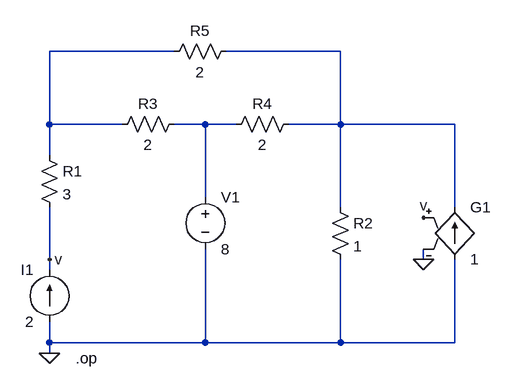
[diagram p0: schematic CH03-KP2-10.asc]
CH03-KP2-10.asc, the LTspice schematic file:
Version 4
SHEET 1 880 680
WIRE 160 96 -32 96
WIRE 416 96 240 96
WIRE -32 208 -32 96
WIRE 80 208 -32 208
WIRE 208 208 160 208
WIRE 256 208 208 208
WIRE 416 208 416 96
WIRE 416 208 336 208
WIRE 592 208 416 208
WIRE -32 256 -32 208
WIRE 208 320 208 208
WIRE 416 336 416 208
WIRE 592 336 592 208
WIRE -32 416 -32 336
WIRE 544 416 544 400
WIRE -32 432 -32 416
WIRE -32 544 -32 512
WIRE 208 544 208 400
WIRE 208 544 -32 544
WIRE 416 544 416 416
WIRE 416 544 208 544
WIRE 592 544 592 416
WIRE 592 544 416 544
WIRE -32 560 -32 544
FLAG -32 560 0
FLAG -32 416 v
FLAG 544 352 v
FLAG 544 416 0
DATAFLAG -32 368 "$"
SYMBOL res -48 240 R0
SYMATTR InstName R1
SYMATTR Value 3
SYMBOL res 400 320 R0
SYMATTR InstName R2
SYMATTR Value 1
SYMBOL res 176 192 R90
WINDOW 0 0 56 VBottom 2
WINDOW 3 32 56 VTop 2
SYMATTR InstName R3
SYMATTR Value 2
SYMBOL res 352 192 R90
WINDOW 0 0 56 VBottom 2
WINDOW 3 32 56 VTop 2
SYMATTR InstName R4
SYMATTR Value 2
SYMBOL res 256 80 R90
WINDOW 0 0 56 VBottom 2
WINDOW 3 32 56 VTop 2
SYMATTR InstName R5
SYMATTR Value 2
SYMBOL current -32 512 R180
WINDOW 0 24 80 Left 2
WINDOW 3 24 0 Left 2
SYMATTR InstName I1
SYMATTR Value 2
SYMBOL voltage 208 304 R0
SYMATTR InstName V1
SYMATTR Value 8
SYMBOL g 592 320 R0
SYMATTR InstName G1
SYMATTR Value 1
TEXT 8 568 Left 2 !.op

The netlist it stands for:
* CH03-KP2-10.asc
R1 N001 v 3
R2 N002 0 1
R3 N003 N001 2
R4 N002 N003 2
R5 N002 N001 2
I1 0 v 2
V1 N003 0 8
G1 0 N002 v 0 1
.op
.backanno
.end